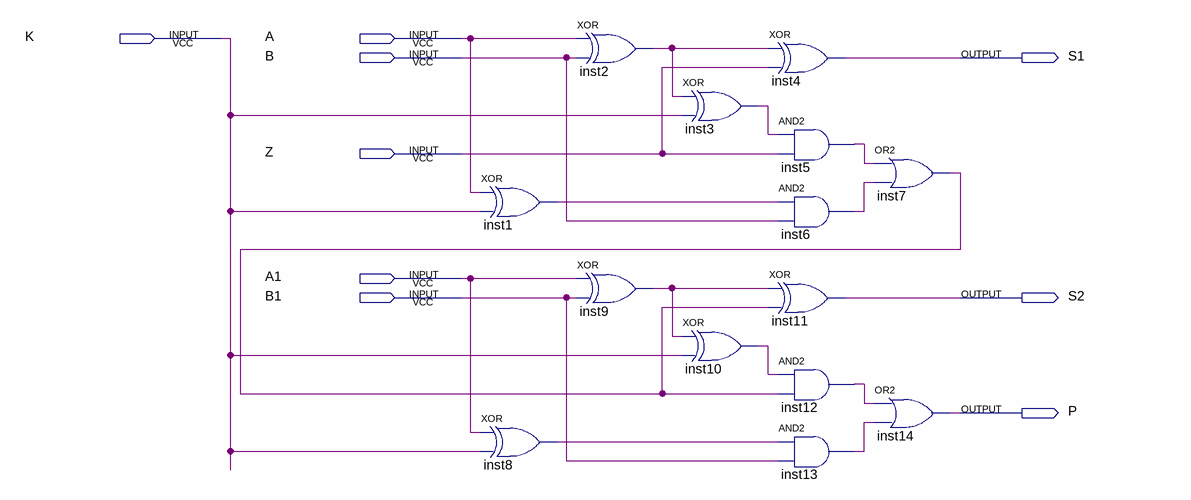
[diagram p0: schematic sheet]
// Quartus schematic labthirdsecond.bdf as structural Verilog: 14 symbols, 9 pins
module labthirdsecond (
  input  K,
  input  A,
  input  B,
  input  Z,
  input  A1,
  input  B1,
  output S1,
  output S2,
  output P
);

  wire inst1_out, inst2_out, inst3_out, inst5_out, inst6_out, inst7_out, inst8_out, inst9_out, inst10_out,
       inst12_out, inst13_out;

  xor inst1 (inst1_out, A, K);
  xor inst8 (inst8_out, A1, K);
  xor inst2 (inst2_out, A, B);
  xor inst9 (inst9_out, A1, B1);
  xor inst3 (inst3_out, inst2_out, K);
  xor inst10 (inst10_out, inst9_out, K);
  xor inst4 (S1, inst2_out, Z);
  and inst5 (inst5_out, inst3_out, Z);
  and inst6 (inst6_out, inst1_out, B);
  xor inst11 (S2, inst9_out, inst7_out);
  and inst12 (inst12_out, inst10_out, inst7_out);
  and inst13 (inst13_out, inst8_out, B1);
  or inst7 (inst7_out, inst5_out, inst6_out);
  or inst14 (P, inst12_out, inst13_out);
endmodule
